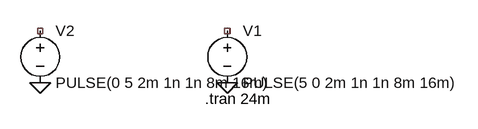
[diagram p0: schematic Draft1.asc]
Draft1.asc, the LTspice schematic file:
Version 4
SHEET 1 880 680
FLAG 192 192 0
FLAG -96 192 0
SYMBOL voltage 192 96 R0
WINDOW 123 0 0 Left 2
WINDOW 39 0 0 Left 2
SYMATTR InstName V1
SYMATTR Value PULSE(5 0 2m 1n 1n 8m 16m)
SYMBOL voltage -96 96 R0
WINDOW 123 0 0 Left 2
WINDOW 39 0 0 Left 2
SYMATTR InstName V2
SYMATTR Value PULSE(0 5 2m 1n 1n 8m 16m)
TEXT 158 216 Left 2 !.tran 24m

The netlist it stands for:
* Draft1.asc
V1 NC_01 0 PULSE(5 0 2m 1n 1n 8m 16m)
V2 NC_02 0 PULSE(0 5 2m 1n 1n 8m 16m)
.tran 24m
.backanno
.end